# Altium schematic sheet sunsensor.SchDoc
size 420 x 297 mm; SheetNumber: 1; SheetTotal: 1; ENG_APP_DATE: --/--/--; DSN_APP_DATE: --/--/--; CHK_APP_DATE: --/--/--
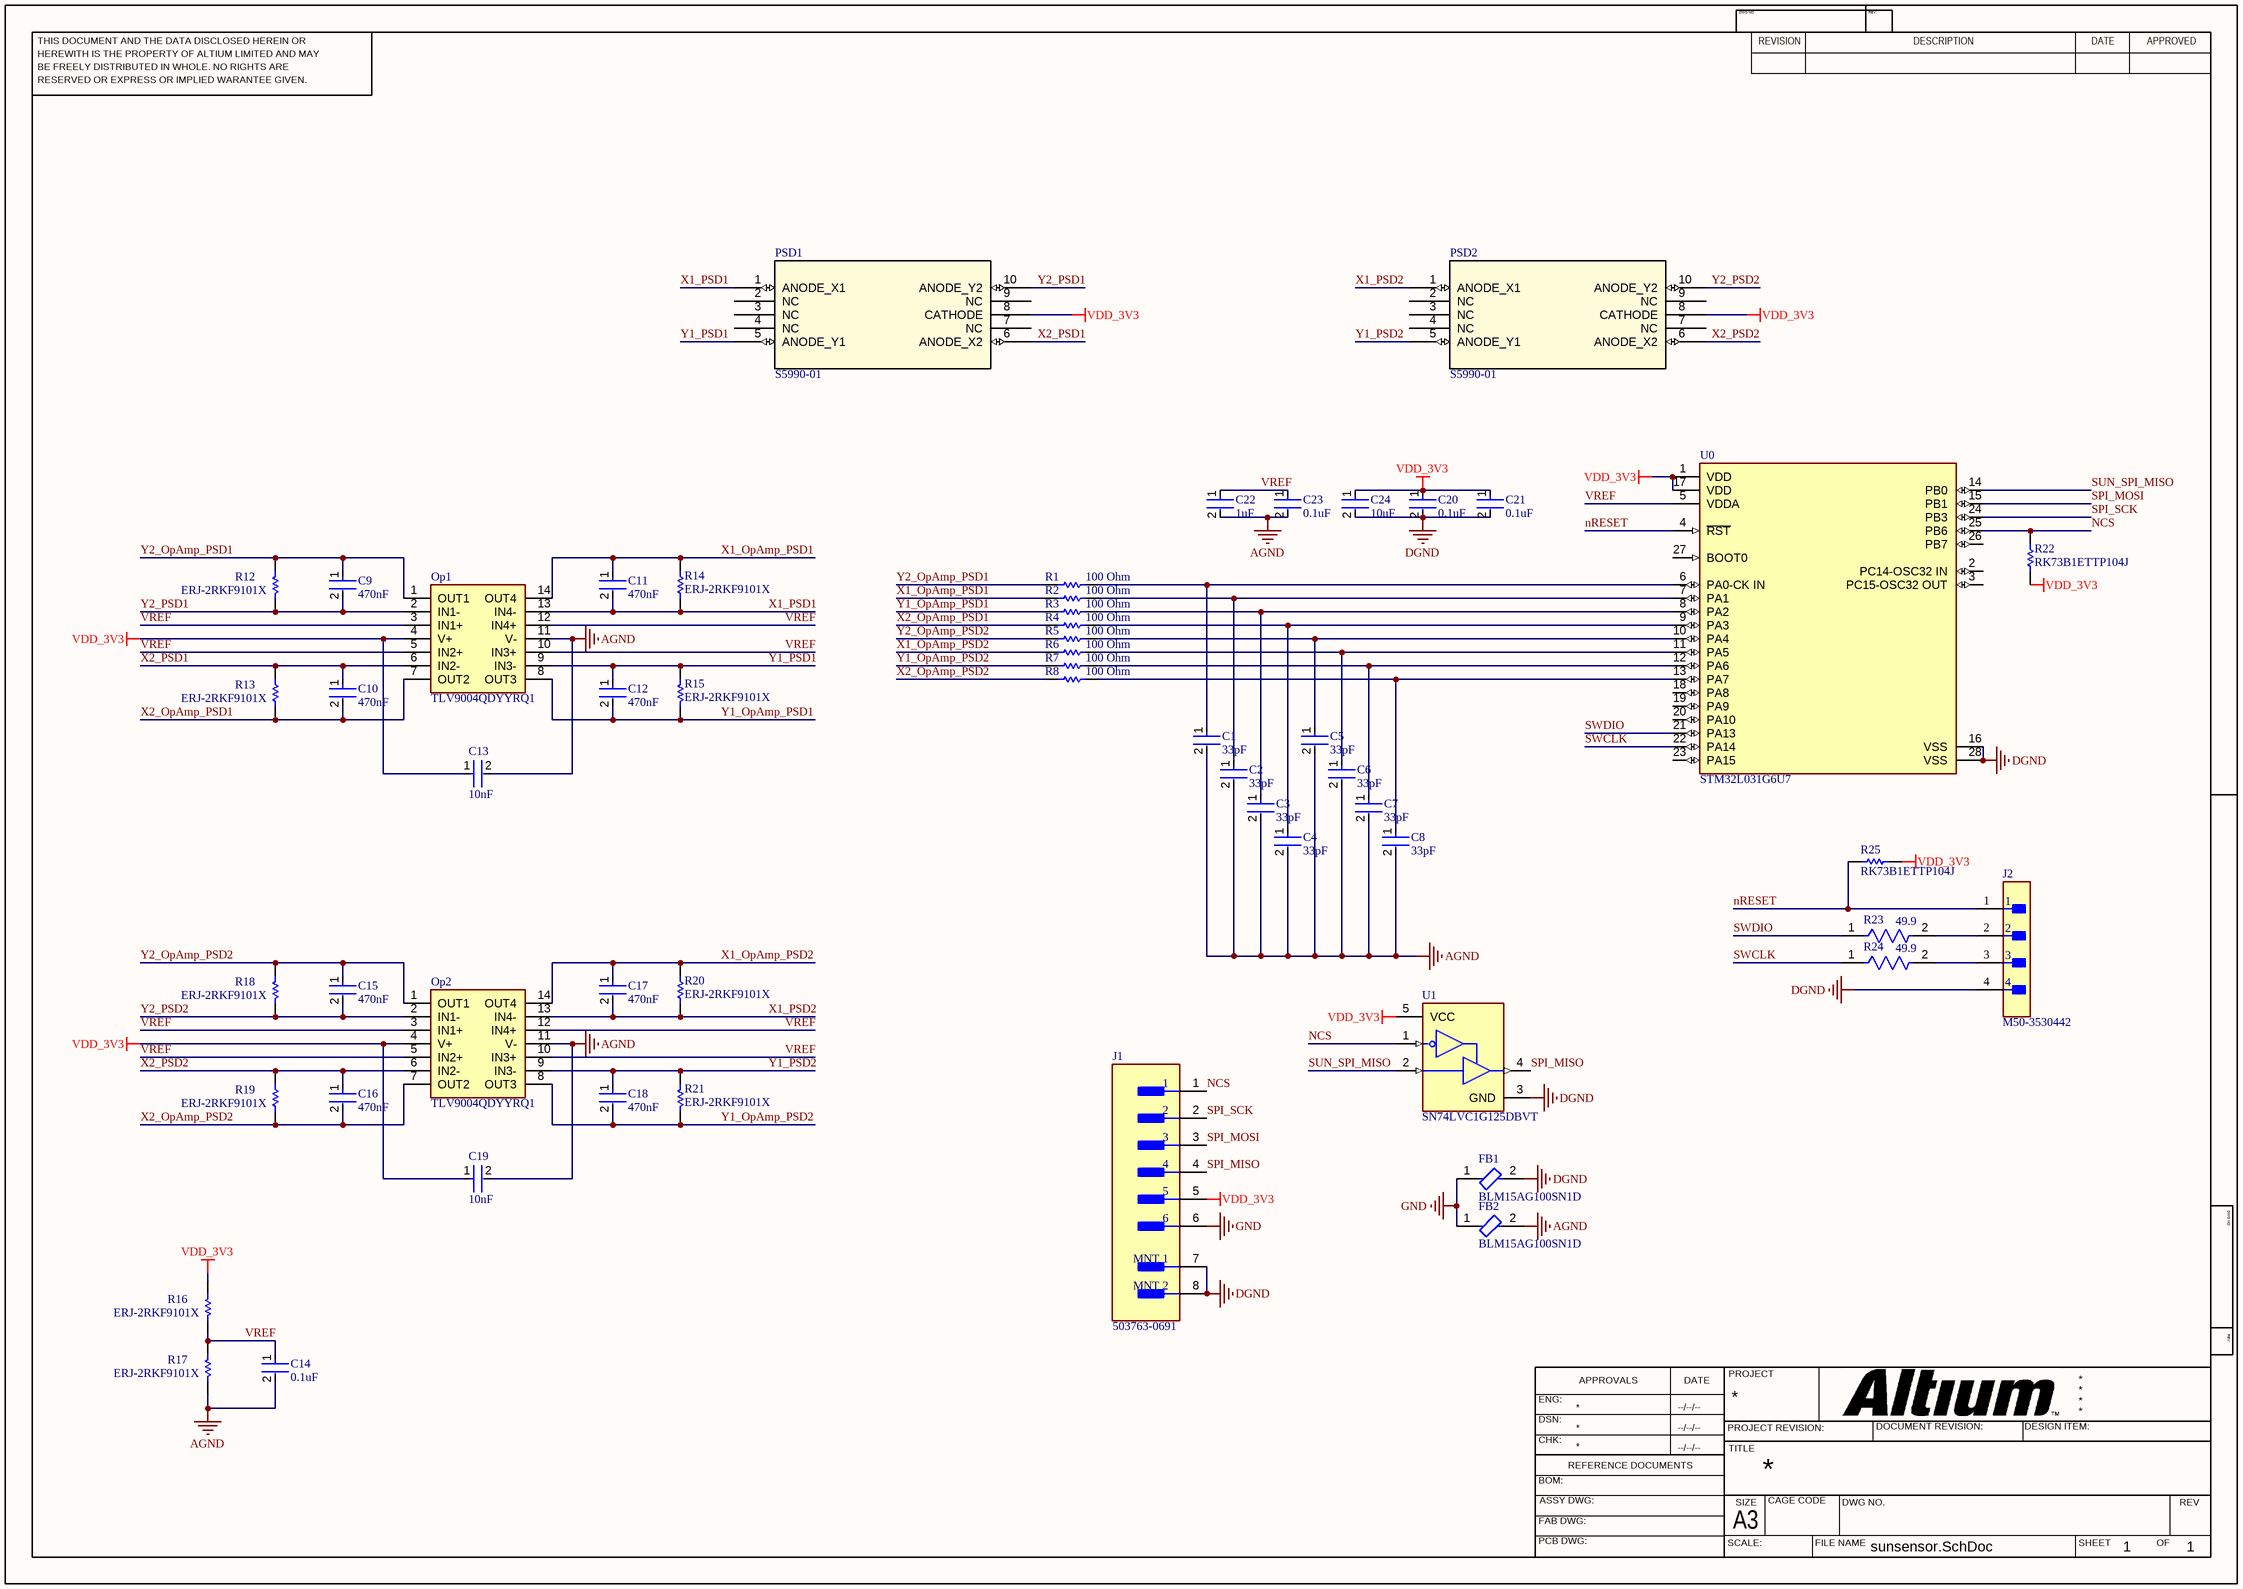
[diagram p0: sunsensor.SchDoc]

## Parts
C1  33pF  [FP-C0402-BB-MFG]
C2  33pF  [FP-C0402-BB-MFG]
C3  33pF  [FP-C0402-BB-MFG]
C4  33pF  [FP-C0402-BB-MFG]
C5  33pF  [FP-C0402-BB-MFG]
C6  33pF  [FP-C0402-BB-MFG]
C7  33pF  [FP-C0402-BB-MFG]
C8  33pF  [FP-C0402-BB-MFG]
C9  470nF  [FP-GRM155-0_05-IPC_C]
C10  470nF  [FP-GRM155-0_05-IPC_C]
C11  470nF  [FP-GRM155-0_05-IPC_C]
C12  470nF  [FP-GRM155-0_05-IPC_C]
C13  10nF  [FP-C0402-BB-MFG]
C14  0.1uF  [FP-C0402-BB-MFG]
C15  470nF  [FP-GRM155-0_05-IPC_C]
C16  470nF  [FP-GRM155-0_05-IPC_C]
C17  470nF  [FP-GRM155-0_05-IPC_C]
C18  470nF  [FP-GRM155-0_05-IPC_C]
C19  10nF  [FP-C0402-BB-MFG]
C20  0.1uF  [FP-C0402-BB-MFG]
C21  0.1uF  [FP-C0402-BB-MFG]
C22  1uF  [FP-C0402C105K8PACTU-MFG]
C23  0.1uF  [FP-C0402-BB-MFG]
C24  10uF  [FP-C0402C106M9PACTU-MFG]
FB1  BLM15AG100SN1D  [FP-BLM15-0_05-IPC_A]
FB2  BLM15AG100SN1D  [FP-BLM15-0_05-IPC_A]
J1  503763-0691  [FP-503763-0691-MFG]
J2  M50-3530442  [FP-M50-3530442-MFG]
Op1  TLV9004QDYYRQ1  [SOP50P326X110-14N]
Op2  TLV9004QDYYRQ1  [SOP50P326X110-14N]
PSD1  S5990-01  [S5990_HAM]
PSD2  S5990-01  [S5990_HAM]
R1  100 Ohm  [RESC1005X40X25ML05T10]
R2  100 Ohm  [RESC1005X40X25ML05T10]
R3  100 Ohm  [RESC1005X40X25ML05T10]
R4  100 Ohm  [RESC1005X40X25ML05T10]
R5  100 Ohm  [RESC1005X40X25ML05T10]
R6  100 Ohm  [RESC1005X40X25ML05T10]
R7  100 Ohm  [RESC1005X40X25ML05T10]
R8  100 Ohm  [RESC1005X40X25ML05T10]
R12  ERJ-2RKF9101X  [RESC1005X40X25LL05T05]
R13  ERJ-2RKF9101X  [RESC1005X40X25LL05T05]
R14  ERJ-2RKF9101X  [RESC1005X40X25LL05T05]
R15  ERJ-2RKF9101X  [RESC1005X40X25LL05T05]
R16  ERJ-2RKF9101X  [RESC1005X40X25LL05T05]
R17  ERJ-2RKF9101X  [RESC1005X40X25LL05T05]
R18  ERJ-2RKF9101X  [RESC1005X40X25LL05T05]
R19  ERJ-2RKF9101X  [RESC1005X40X25LL05T05]
R20  ERJ-2RKF9101X  [RESC1005X40X25LL05T05]
R21  ERJ-2RKF9101X  [RESC1005X40X25LL05T05]
R22  RK73B1ETTP104J  [RESC1005X40X25ML10T10]
R23  49.9  [FP-ERJ2RK-MFG]
R24  49.9  [FP-ERJ2RK-MFG]
R25  RK73B1ETTP104J  [RESC1005X40X25ML10T10]
U0  STM32L031G6U7  [FP-UFQFPN28-A0B0-MFG]
U1  SN74LVC1G125DBVT  [FP-DBV0005A-MFG]

## Nets
AGND: C1.2 C2.2 C3.2 C4.2 C5.2 C6.2 C7.2 C8.2 C13.2 C14.2 C19.2 C22.2 C23.2 FB2.2 Op1.11(V-) Op2.11(V-) R17.1
DGND: C20.2 C21.2 C24.2 FB1.2 J1.7(MNT_1) J1.8(MNT_2) J2.4 U0.16(VSS) U0.28(VSS) U1.3(GND)
GND: FB1.1 FB2.1 J1.6
VDD_3V3: C13.1 C19.1 C20.1 C21.1 C24.1 J1.5 Op1.4(V+) Op2.4(V+) PSD1.8(CATHODE) PSD2.8(CATHODE) R16.2 R22.1 R25.1 U0.1(VDD) U0.17(VDD) U1.5(VCC)
NCS: J1.1 R22.2 U0.25(PB6) U1.1(~{OE})
nRESET: J2.1 R25.2 U0.4(~{RST})
SPI_MISO: J1.4 U1.4(Y)
SPI_MOSI: J1.3 U0.15(PB1)
SPI_SCK: J1.2 U0.24(PB3)
SUN_SPI_MISO: U0.14(PB0) U1.2(A)
SWCLK: R24.1 U0.22(PA14)
SWDIO: R23.1 U0.21(PA13)
VREF: C14.1 C22.1 C23.1 Op1.3(IN1+) Op1.5(IN2+) Op1.10(IN3+) Op1.12(IN4+) Op2.3(IN1+) Op2.5(IN2+) Op2.10(IN3+) Op2.12(IN4+) R16.1 R17.2 U0.5(VDDA)
X1_OpAmp_PSD1: C11.1 Op1.14(OUT4) R2.1 R14.2
X1_OpAmp_PSD2: C17.1 Op2.14(OUT4) R6.1 R20.2
X1_PSD1: C11.2 Op1.13(IN4-) PSD1.1(ANODE_X1) R14.1
X1_PSD2: C17.2 Op2.13(IN4-) PSD2.1(ANODE_X1) R20.1
X2_OpAmp_PSD1: C10.2 Op1.7(OUT2) R4.1 R13.2
X2_OpAmp_PSD2: C16.2 Op2.7(OUT2) R8.1 R19.2
X2_PSD1: C10.1 Op1.6(IN2-) PSD1.6(ANODE_X2) R13.1
X2_PSD2: C16.1 Op2.6(IN2-) PSD2.6(ANODE_X2) R19.1
Y1_OpAmp_PSD1: C12.2 Op1.8(OUT3) R3.1 R15.2
Y1_OpAmp_PSD2: C18.2 Op2.8(OUT3) R7.1 R21.2
Y1_PSD1: C12.1 Op1.9(IN3-) PSD1.5(ANODE_Y1) R15.1
Y1_PSD2: C18.1 Op2.9(IN3-) PSD2.5(ANODE_Y1) R21.1
Y2_OpAmp_PSD1: C9.1 Op1.1(OUT1) R1.1 R12.2
Y2_OpAmp_PSD2: C15.1 Op2.1(OUT1) R5.1 R18.2
Y2_PSD1: C9.2 Op1.2(IN1-) PSD1.10(ANODE_Y2) R12.1
Y2_PSD2: C15.2 Op2.2(IN1-) PSD2.10(ANODE_Y2) R18.1
NetC1_1: C1.1 R1.2 U0.6(PA0-CK_IN)
NetC2_1: C2.1 R2.2 U0.7(PA1)
NetC3_1: C3.1 R3.2 U0.8(PA2)
NetC4_1: C4.1 R4.2 U0.9(PA3)
NetC5_1: C5.1 R5.2 U0.10(PA4)
NetC6_1: C6.1 R6.2 U0.11(PA5)
NetC7_1: C7.1 R7.2 U0.12(PA6)
NetC8_1: C8.1 R8.2 U0.13(PA7)
NetJ2_2: J2.2 R23.2
NetJ2_3: J2.3 R24.2

Not connected (* = marked no-connect by the designer): PSD1 2(NC) 3(NC) 4(NC) 7(NC) 9(NC); PSD2 2(NC) 3(NC) 4(NC) 7(NC) 9(NC); U0 2(PC14-OSC32_IN) 3(PC15-OSC32_OUT) 18(PA8) 19(PA9) 20(PA10) 23(PA15) 26(PB7) 27(BOOT0)

## Notes on the sheet
- THIS DOCUMENT AND THE DATA DISCLOSED HEREIN OR
- HEREWITH IS THE PROPERTY OF ALTIUM LIMITED AND MAY
- DWG NO:
- REVISION
- REV:
- DESCRIPTION
- DATE
- APPROVED
- BE FREELY DISTRIBUTED IN WHOLE. NO RIGHTS ARE
- RESERVED OR EXPRESS OR IMPLIED WARANTEE GIVEN.
- ENG:
- APPROVALS
- PROJECT
- DSN:
- CHK:
- REFERENCE DOCUMENTS
- PROJECT REVISION:
- TITLE
- DOCUMENT REVISION:
- DESIGN ITEM:
- BOM:
- FAB DWG:
- PCB DWG:
- ASSY DWG:
- SCALE:
- A3
- SIZE
- CAGE CODE
- FILE NAME
- DWG NO.
- SHEET
- OF
- REV

## Library data of the parts
C1-C8 = CMP-2008-03563-2: CAP CER 33PF 50V C0G/NP0 0402; Manufacturer Part Number: C0402C330F5GACTU; Manufacturer: Kemet; Material: Ceramic; Tolerance: 0.01; Temperature Coefficient: 15%; Temperature Characteristic: C0G; Temperature: -55°C to +125°C; Digikey Description: CAP CER 33PF 50V C0G/NP0 0402; Temperature Range Low: -55°C; RoHS: TRUE; ComponentLink2Description: Datasheet; Ipc Land Pattern Name: CAPC10050X50; Device Class L2: Capacitors; Temperature Range High: +125°C; Height: 0.55mm; Lead Free: Yes; Category: Cap; Automotive: No; ComponentLink2URL: https://content.kemet.com/datasheets/KEM_C1002_X7R_SMD.pdf; Mouser Description: Multilayer Ceramic Capacitors MLCC - SMD/SMT 50volts 33pF C0G 1%; Value: 33 pF; Device Class L1: Passive Components; Device Class L3: Ceramic Capacitors; Voltage Rating: 50 V; Octopart: https://octopart.com/c0402c330f5gactu-kemet-17141442; Capacitance: 33 pF; Package: C0402-BB
C9-C12 C15-C18 = CMP-06035-042090-1: Chip Multilayer Ceramic Capacitors for General Purpose, 0402, 0.47uF, X7R, 15%, 10%, 10V; Tolerance: 10%; Voltage Rating (DC): 10V; Material: Ceramic; Width: 0.5mm; Case/Package: 0402; Capacitance: 470nF; Thickness: 500um; Height: 0.3mm; Length: 1mm; Lead Free: Lead Free
C13 C19 = CMP-2008-02109-2: CAP CER 10000PF 50V X7R 0402; Manufacturer: Kemet; Manufacturer Part Number: C0402C103K5RACTU; Temperature Coefficient: 15%; Tolerance: 0.1; Value: 10,000 pF; Material: Ceramic; Device Class L3: Ceramic Capacitors; Digikey Description: CAP CER 10000PF 50V X7R 0402; Height: 0.55mm; Temperature Range Low: -55°C; Package: C0402-BB; ComponentLink2URL: https://content.kemet.com/datasheets/KEM_C1002_X7R_SMD.pdf; Lead Free: Yes; Mouser Description: Capacitor; Ceramic; Cap; .010uF; Tol 10%; SMT; Vol-Rtg 50V; X7R; Tape and Reel; Ipc Land Pattern Name: CAPC10050X50; Temperature Range High: +125°C; Device Class L1: Passive Components; Category: Cap; Octopart: https://octopart.com/c0402c103k5ractu-kemet-95985; Temperature Characteristic: X7R; Automotive: No; Device Class L2: Capacitors; ComponentLink2Description: Datasheet; Voltage Rating: 50 V; Capacitance: 10,000 pF; RoHS: TRUE; Temperature: -55°C to +125°C
C14 C20 C21 C23 = CMP-2008-02108-2: CAP CER 0.1UF 16V X7R 0402; Manufacturer: Kemet; Manufacturer Part Number: C0402C104K4RACTU; Value: 0.10 μF; Tolerance: 0.1; Material: Ceramic; Temperature Coefficient: 15%; Voltage Rating: 16 V; Package: C0402-BB; Automotive: No; Ipc Land Pattern Name: CAPC10050X50; Device Class L3: Ceramic Capacitors; Capacitance: 0.10 μF; Octopart: https://octopart.com/c0402c104k4ractu-kemet-94158; Temperature Characteristic: X7R; Mouser Description: Cap Ceramic 0.1uF 16V X7R 10% SMD 0402 125?C Paper T/R - Tape and Reel (Alt: C0402C104K4RAC TU); ComponentLink2Description: Datasheet; Temperature Range Low: -55°C; RoHS: TRUE; Device Class L1: Passive Components; Temperature Range High: +125°C; Device Class L2: Capacitors; ComponentLink2URL: https://content.kemet.com/datasheets/KEM_C1002_X7R_SMD.pdf; Category: Cap; Height: 0.55mm; Temperature: -55°C to +125°C; Lead Free: Yes; Digikey Description: CAP CER 0.1UF 16V X7R 0402
C22 = CMP-2008-02081-2: CAP CER 1UF 10V X5R 0402; Dielectric Material: Ceramic; Dissipation Factor: 5%; Tolerance: 10%; Number of Pins: 2; Contact Plating: Tin; Min Operating Temperature: -55°C; Termination: SMD/SMT; Lead Free: Lead Free; Construction: Flat; Voltage Rating (DC): 10V; Mount: Surface Mount; Series: C; Thickness: 0.022inch; Width: 0.5mm; Radiation Hardening: No; Capacitance: 1uF; Dielectric: X5R; Height: 0.5mm; Voltage: 10V; Length: 1mm; Depth: 0.5mm; Max Operating Temperature: 85°C; Package Quantity: 1; Packaging: Tape and Reel; RoHS Compliant: Yes; Case Code (Imperial): 0402; Case Code (Metric): 1005; REACH SVHC: No SVHC; Voltage Rating: 10V; Case/Package: 0402
C24 = CMP-03020-034678-1: CAP CER 10UF 6.3V X5R 0402; Tolerance: 20%; Dielectric Material: Ceramic; Voltage Rating: 6.3V; Thickness: 0.028inch; REACH SVHC: No SVHC; RoHS Compliant: Yes; Case Code (Metric): 1005; Lead Free: Lead Free; Length: 0.039inch; Max Operating Temperature: 85°C; Capacitance: 10uF; Voltage Rating (DC): 6.3V; Min Operating Temperature: -55°C; Case/Package: 0402; Mount: Surface Mount; Case Code (Imperial): 0402; Dielectric: X5R; Packaging: Cut Tape; Width: 0.02inch
FB1 FB2 = CMP-0686-00176-4: Chip Ferrite Bead, 0402, 10Ω @ 100MHz, 0.025Ω, 25%, 1A; Number of Circuits: 1; DC Resistance (DCR): 25mR; Shielding: Unshielded; Resistance: 50mR; Impedance: 10R; Max Current Rating: 1A; Length: 1mm; Min Operating Temperature: -55°C; Case Code (Imperial): 0402; Current Rating: 1A; Termination: SMD/SMT; Test Frequency: 100MHz; Depth: 0.55mm; Package Quantity: 1; Packaging: Tape and Reel; Height: 0.5mm; Max DC Current: 1A; DC Current: 1A; RoHS Compliant: Yes; Resistor Type: Ferrite Bead; Tolerance: 25%; Number of Lines: 1; Lead Free: Lead Free; Max Operating Temperature: 125°C; Core Material: Ferrite; Case Code (Metric): 1005; REACH SVHC: No SVHC; Width: 0.5mm; Radiation Hardening: No; Number of Pins: 2; Material: Ferrite; Case/Package: 0402; Military Standard: Not; Weight: 2.3E-05oz
J1 = CMP-04776-000530-1: CONN HEADER SMD R/A 6POS 1MM
J2 = CMP-15831-000059-1: CONN HEADER VERT 4POS 1.27MM; Current Rating: 1A; Number of Positions: 4; Insulation Material: Nylon; Contact Material: Brass; Insulation Color: Black; Mount: Through Hole; Min Operating Temperature: -40°C; Number of Rows: 1; Contact Plating: Gold; Contact Shape: Square; Flammability Rating: UL94 V-0; Connector Type: Header; Max Operating Temperature: 105°C; Packaging: Bulk; Fastening Type: Push; Termination: Solder
Op1 Op2 = TLV9004QDYYRQ1: Integrated Circuit; Manufacturer_Name: Texas Instruments; Datasheet Link: https://www.ti.com/lit/ds/symlink/tlv9004-q1.pdf?ts=1653903936376&ref_url=https%253A%252F%252Fwww.ti.com%252Fproduct%252FTLV9004-Q1%252Fpart-details%252FTLV9004QDYYRQ1; Height: 1.1mm; Manufacturer_Part_Number: TLV9004QDYYRQ1; Mouser Part Number: 595-TLV9004QDYYRQ1; Mouser Price/Stock: https://www.mouser.co.uk/ProductDetail/Texas-Instruments/TLV9004QDYYRQ1?qs=A6eO%252BMLsxmQxCVD4nSHH0g%3D%3D; Arrow Part Number: TLV9004QDYYRQ1; Arrow Price/Stock: https://www.arrow.com/en/products/tlv9004qdyyrq1/texas-instruments?utm_currency=USD&region=nac
PSD1 PSD2 = CMP-075-000001-1: No Description Available; Mfr_Name: Hamamatsu; RefDes: RefDes; Type: Position Sensors - Angle, Linear Position Measuring; Design Item ID: S5990-01; Source: S5990-01.SchLib
R1-R8 = CMP-2002-06458-1: Part Number: ERJ-U02F1000X; Manufacturer: Panasonic
R12-R21 = CMP-1011-00619-2: Manufacturer: Panasonic; Part Number: ERJ-2RKF9101X
R22 R25 = CMP-2002-03715-1: Manufacturer: KOA Speer; Part Number: RK73B1ETTP104J
R23 R24 = CMP-2002-00969-2: RES SMD 49.9 OHM 1% 1/10W 0402; Voltage Rating (DC): 50V; Temperature Coefficient: 100ppm/°C; Power Rating: 100mW; Resistance: 49.9R; Resistance Tolerance: 1%; Height: 0.35mm; Lead Free: Lead Free; Construction: Rectangular; Termination: SMD/SMT; Radiation Hardening: No; Military Standard: Not; Max Operating Temperature: 155°C; Packaging: Tape and Reel; Tolerance: 1%; Voltage Rating: 50V; Series: ERJ; Features: Automotive AEC-Q200; Mount: Surface Mount; Case/Package: 0402; Max Power Dissipation: 100mW; Case Code (Metric): 1005; Depth: 0.5mm; Width: 0.02inch; Technology: THICK FILM; Min Operating Temperature: -55°C; Length: 1mm; Resistor Type: Thick Film; Number of Terminations: 2; Contact Plating: Tin; Case Code (Imperial): 0402; RoHS Compliant: Yes; Working Voltage: 50V; Package Quantity: 1
U0 = CMP-12105-000084-1: IC MCU 32BIT 32KB FLASH 28UFQFPN; Oscillator Type: Internal; Core Architecture: ARM; Peripherals: Brown-out Detect/Reset; Interface: I2C; Watchdog Timer: Yes; Max Power Dissipation: 167mW; Max Frequency: 32MHz; Operating Supply Voltage: 3.3V; Number of Timers/Counters: 4; Max Supply Voltage: 3.6V; RAM Size: 1KB; Number of Programmable I/O: 21; Min Supply Voltage: 1.8V; Lead Free: Lead Free; Mount: Surface Mount; Min Operating Temperature: -40°C; Frequency: 32MHz; Max Operating Temperature: 105°C; Number of Pins: 28; Memory Type: FLASH; Number of I/Os: 21; Memory Size: 32KB
U1 = CMP-0859-00018-4: IC BUF NON-INVERT 5.5V SOT23-5; Manufacturer: Texas Instruments; Min Supply Voltage: 1.65V; Number Of Outputs: 1; Propagation Delay: 4.2ns; Logic Function Desc: Non-Inverting; Nominal Supply Current: 10uA; Standoff Height: 0mm; ComponentLink2Description: Datasheet; Temperature Range High: +125°C; Octopart: https://octopart.com/sn74lvc1g125dbvt-texas+instruments-1006799; Ambient Temperature Range Low: -40°C; Temperature: -40°C to +125°C; Mouser Description: Buffers & Line Drivers SNGL Bus Buffer Gate; Automotive: No; RoHS: TRUE; Device Class L2: Logic ICs; Ambient Temperature Range High: +125°C; ComponentLink2URL: http://www.ti.com/lit/ds/symlink/sn74lvc1g125.pdf; Height: 1.45mm; Number Of Circuits: 1; Device Class L1: Integrated Circuits (ICs); Max Supply Voltage: 5.5V; Manufacturer Part Number: SN74LVC1G125DBVT; Temperature Range Low: -40°C; Package: DBV0005A; Device Class L3: Logic Gates; Number Of Inputs: 1; Lead Free: Yes; Category: IC; Digikey Description: IC BUF NON-INVERT 5.5V SOT23-5